# EAGLE design DRV8818_single_axis (EAGLE 7.6.0)
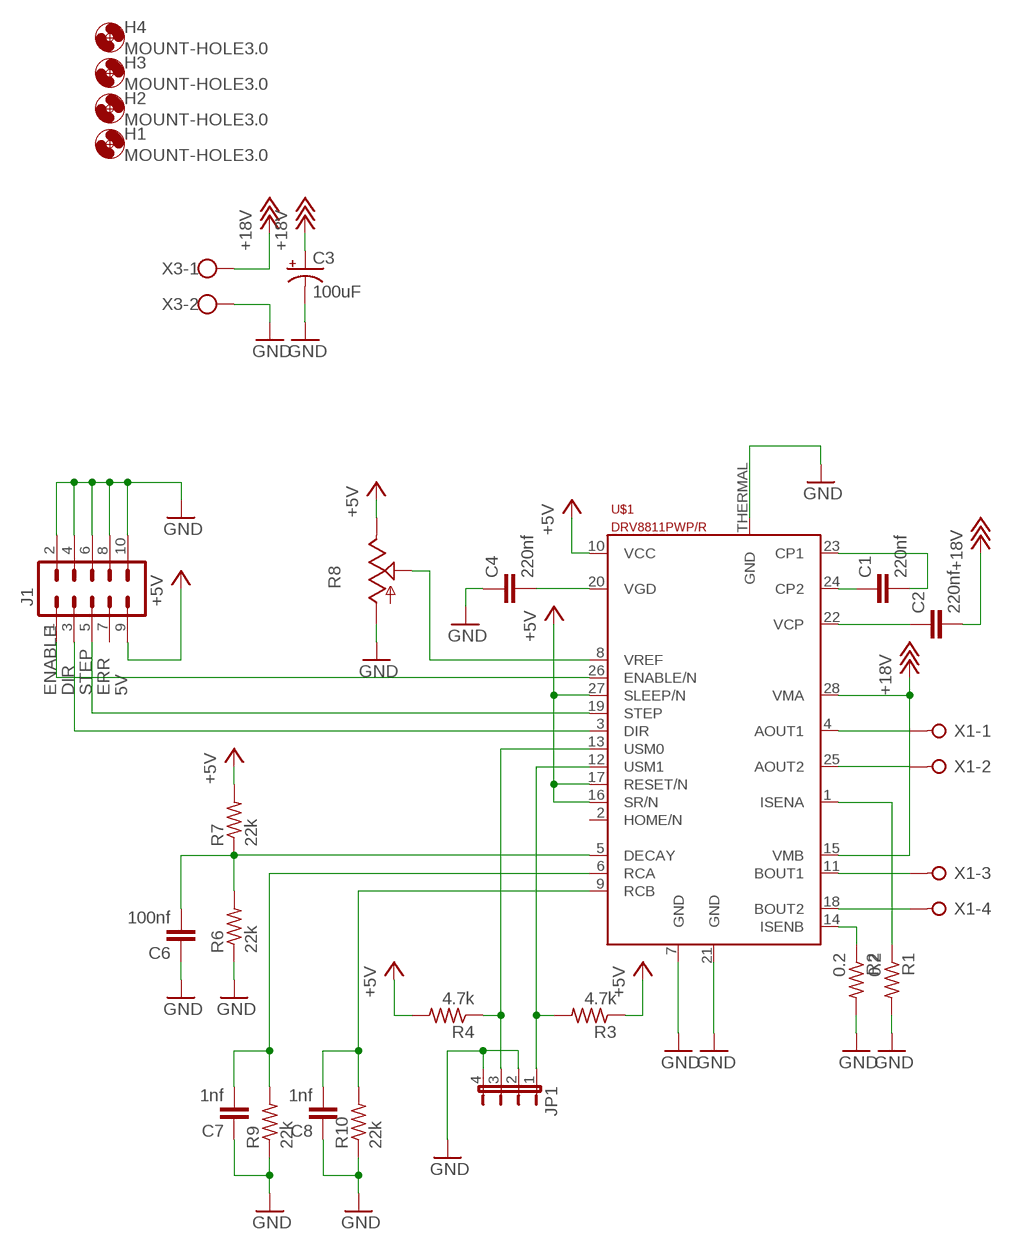
[diagram p0: schematic, sheet 1]

## Parts
C1  220nf  C-EUC1206  [C1206]
C2  220nf  C-EUC1206  [C1206]
C3  100uF  100UF-63V-20%(ELECT)  [NIC_10X10.5_CAP]
C4  220nf  C-EUC1206  [C1206]
C6  100nf  C-EUC1206  [C1206]
C7  1nf  C-EUC1206  [C1206]
C8  1nf  C-EUC1206  [C1206]
H1  MOUNT-HOLE3.0  [3,0]
H2  MOUNT-HOLE3.0  [3,0]
H3  MOUNT-HOLE3.0  [3,0]
H4  MOUNT-HOLE3.0  [3,0]
J1  M05X2SHD_LOCK  [2X5-SHROUDED_LOCK]
JP1  JP4E  [JP4]
R1  0.2  R-US_R2512  [R2512]
R2  0.2  R-US_R2512  [R2512]
R3  4.7k  R-US_R1206  [R1206]
R4  4.7k  R-US_R1206  [R1206]
R6  22k  R-US_R1206  [R1206]
R7  22k  R-US_R1206  [R1206]
R8  TRIM_US-CA6V  [CA6V]
R9  22k  R-US_R1206  [R1206]
R10  22k  R-US_R1206  [R1206]
U$1  DRV8811PWP/R  [HTSSOP28]
X1  W237-04P  [W237-4P]
X3  W237-102  [W237-102]

## Nets
+5V: J1.9 R3.1 R4.2 R7.2 R8.E U$1.10(VCC) U$1.16(SR/N) U$1.17(RESET/N) U$1.27(SLEEP/N)
+18V: C2.2 C3.+ U$1.15(VMB) U$1.28(VMA) X3.1
DIR: J1.3 U$1.3(DIR)
ENABLE: J1.1 U$1.26(ENABLE/N)
GND: C3.- C4.1 C6.1 C7.1 C8.1 J1.2 J1.4 J1.6 J1.8 J1.10 JP1.2 JP1.4 R1.2 R2.2 R6.1 R8.A R9.1 R10.1 U$1.7(GND) U$1.21(GND) U$1.THERMAL(GND) X3.2
ISENA: R1.1 U$1.1(ISENA)
ISENB: R2.1 U$1.14(ISENB)
N$1: U$1.11(BOUT1) X1.3
N$2: U$1.18(BOUT2) X1.4
N$3: U$1.4(AOUT1) X1.1
N$4: U$1.25(AOUT2) X1.2
N$7: C1.1 U$1.24(CP2)
N$8: C1.2 U$1.23(CP1)
N$9: C4.2 U$1.20(VGD)
N$10: JP1.1 R3.2 U$1.12(USM1)
N$11: C2.1 U$1.22(VCP)
N$12: JP1.3 R4.1 U$1.13(USM0)
N$18: C6.2 R6.2 R7.1 U$1.5(DECAY)
N$19: C8.2 R10.2 U$1.9(RCB)
N$22: C7.2 R9.2 U$1.6(RCA)
STEP: J1.5 U$1.19(STEP)
VREF: R8.S U$1.8(VREF)
Unconnected: J1.7 U$1.2(HOME/N)

## Notes on the sheet
- ENABLE | DIR | STEP | ERR | 5V

## Library data of the parts
C1 C2 C4 C6-C8 = resistor:C-EU: CAPACITOR, European symbol
C3 = SparkFun-Capacitors:100UF-63V-20%(ELECT): CAP-08362 100uF electrolytic SMT 63V 20%; PROD_ID: CAP-08362
H1-H4 = holes:MOUNT-HOLE: MOUNTING HOLE with drill center marker
J1 = SparkFun-Connectors:M05X2: Header 5x2 Standard 10-pin dual row 0.1" header. Commonly used with AVR-ISP. Use with Spark Fun Electronics SKU: PRT-00778
JP1 = jumper:JP4E: JUMPER
R1-R4 R6 R7 R9 R10 = resistor:R-US_: RESISTOR, American symbol
R8 = pot:TRIM_US-: POTENTIOMETER
U$1 = texas-drv8811:DRV8811: Stepper Motor Controller The DRV8811 IC provides an integrated stepper motor driver solution. The device has two H-bridge drivers, as well as microstepping indexer logic to control a stepper motor. The output driver block for each consists of N-channel power MOSFETs configured as full H-bridges to drive the motor windings. Source: http://www.ti.com/lit/ds/symlink/drv8811.pdf; MF: TEXAS INSTRUMENTS
X1 = con-wago-508:W237-04P: WAGO SREW CLAMP; OC_FARNELL: unknown; OC_NEWARK: unknown
X3 = con-wago-500:W237-102: WAGO SCREW CLAMP; MPN: 237-102; OC_FARNELL: unknown; OC_NEWARK: 70K9898

## Board
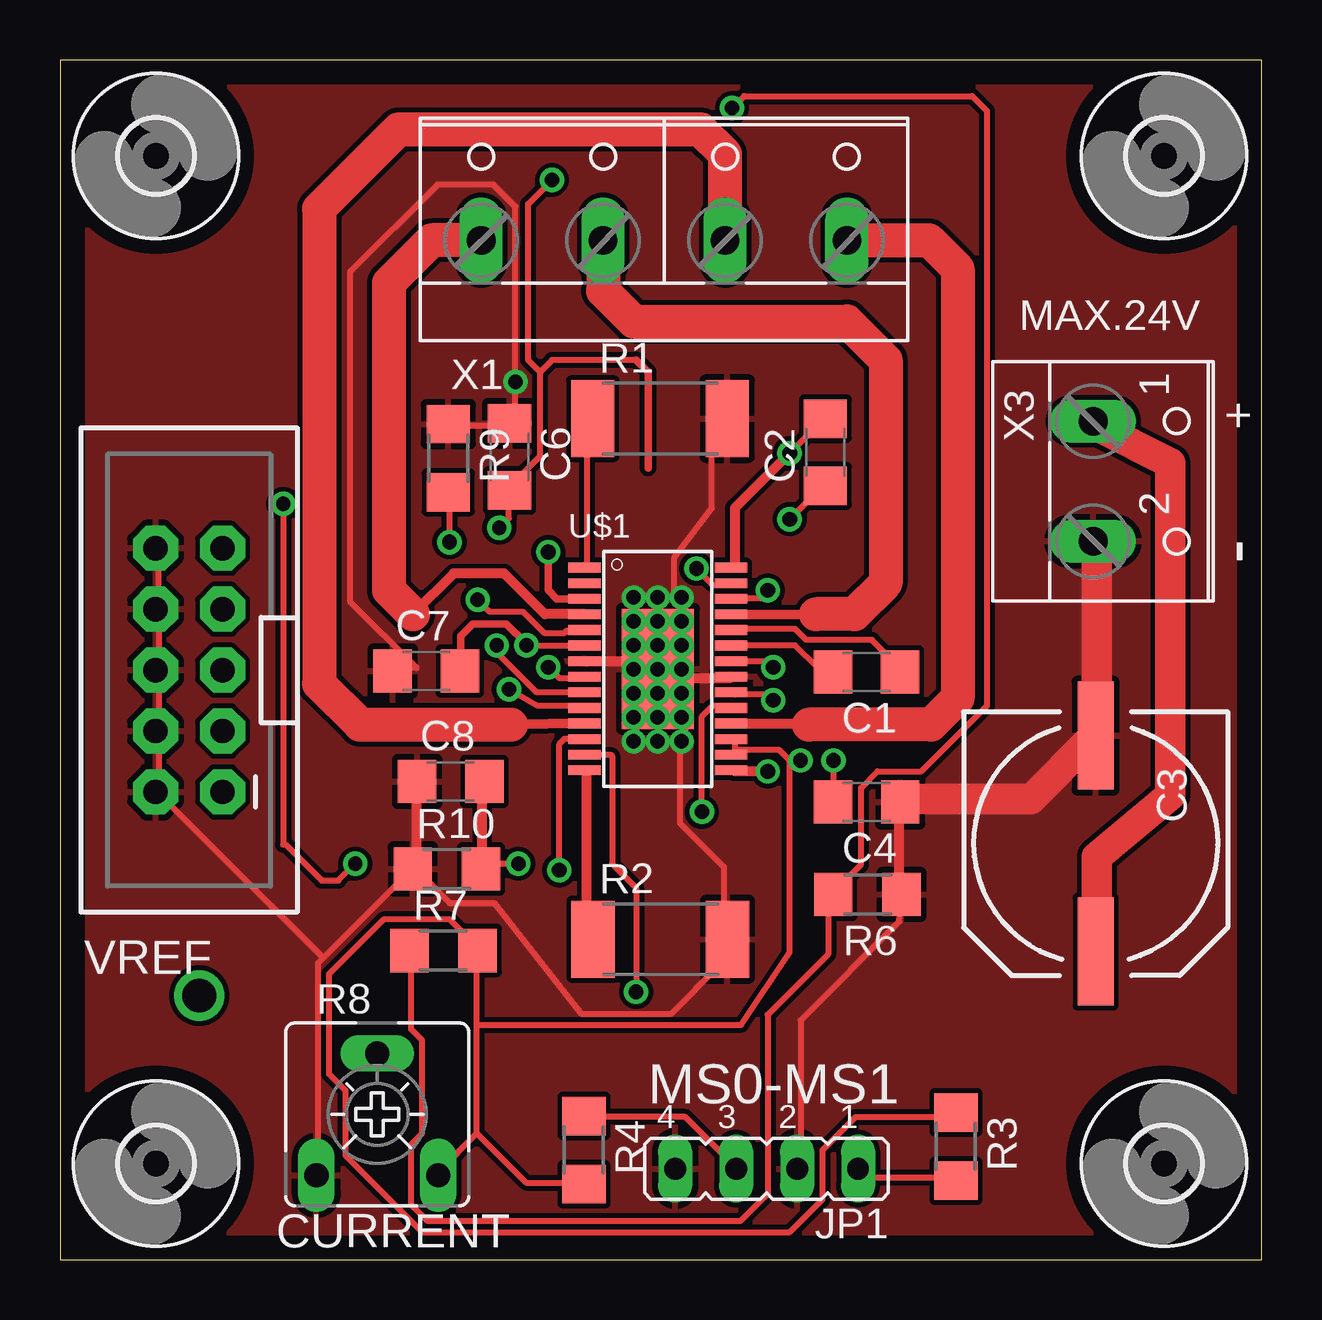
[diagram p1: board, top side]
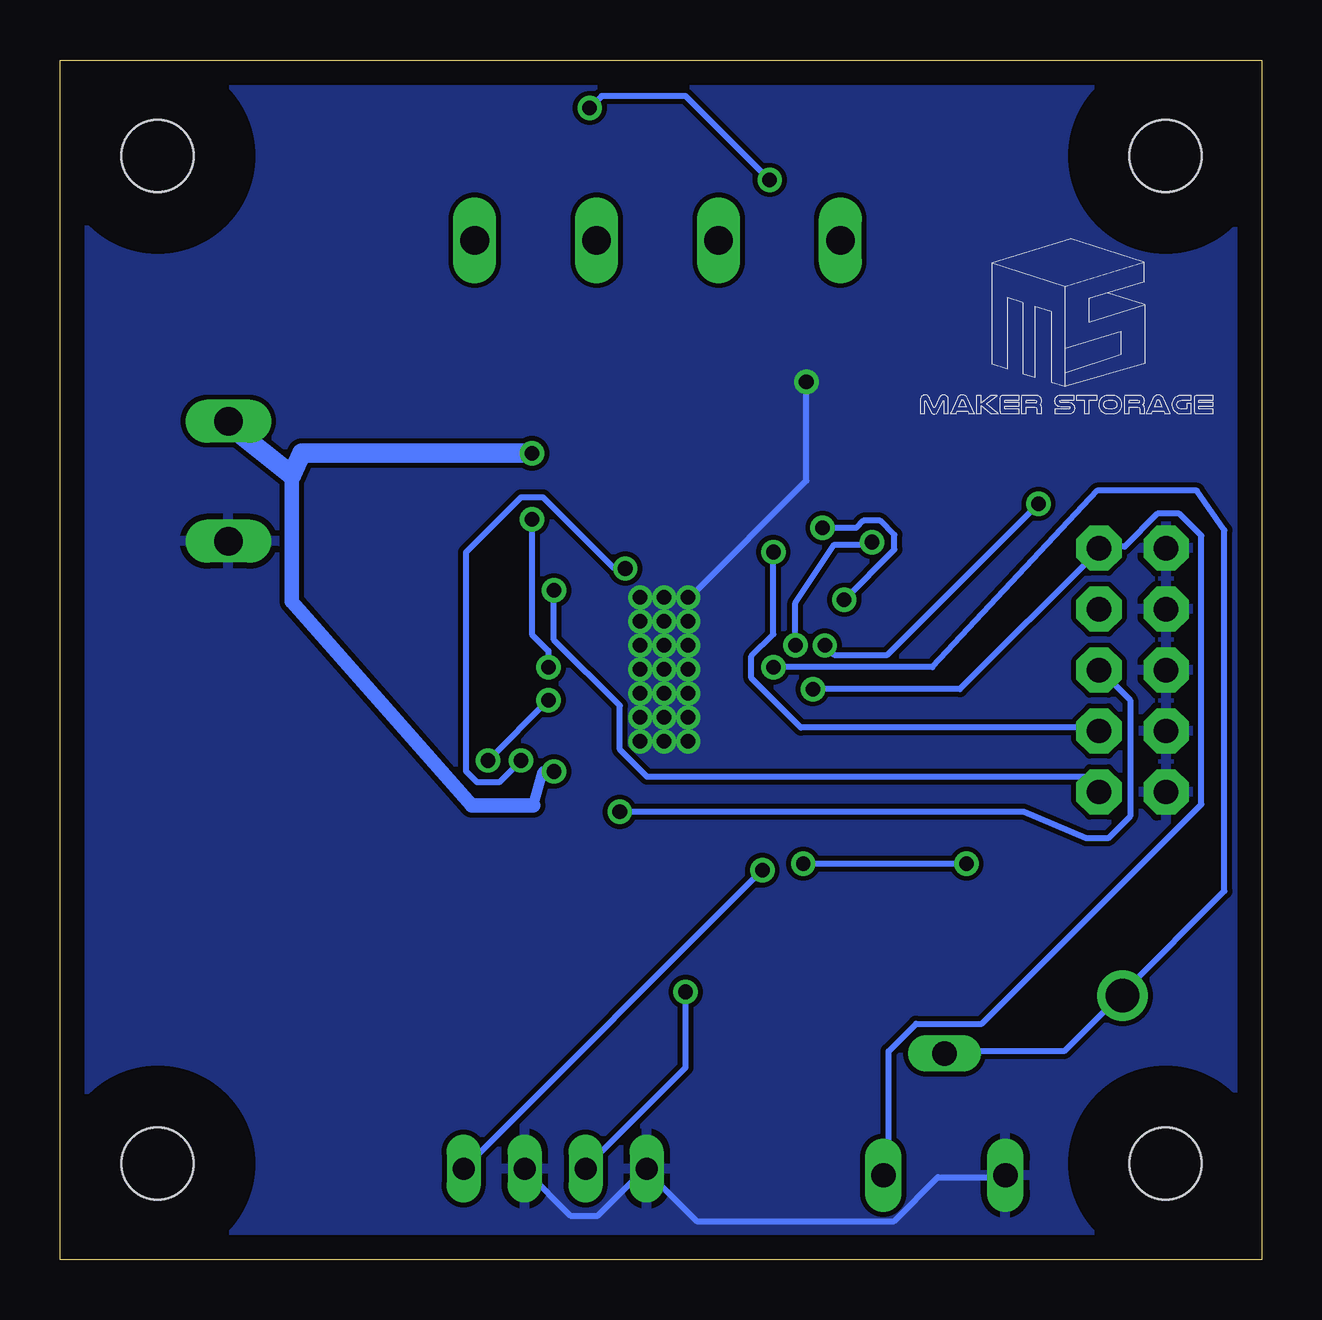
[diagram p2: board, bottom side, seen from below]

Size 50.07 x 50 mm. Coordinates in mm from the lower left corner, seen from the top.
Outline: 0,0 50.07,0 50.07,50 0,50 0,0
Copper layers (1*16): Top 0.035mm / dielectric 1.5mm / Bottom 0.035mm
Design rules "default": minimum track width 10mil, minimum drill 24mil, track to track 8mil, track to pad 8mil, pad to pad 8mil, via to via 8mil, smd to smd 8mil, copper to edge 40mil, drill to drill 8mil, minimum pad ring 10mil, minimum via ring 8mil, stop-mask expansion 4mil, vias tented up to drill 0mil, thermal gap 10mil

### Footprints (pad centres in the part's own frame; a part is rotated, then mirrored left to right if it is on the bottom)
C1206 = smd 1.6 x 1.8: 1 -1.4,0; 2 1.4,0
NIC_10X10.5_CAP = smd 4.5 x 1.5: + 4.5,0; - -4.5,0
3,0 = hole 3: 0,0
2X5-SHROUDED_LOCK = drill 1.016 pad 1.88 octagon: 1 -1.397,5.08; 2 1.397,5.08; 3 -1.397,2.54; 4 1.397,2.54; 5 -1.397,0; 6 1.397,0; 7 -1.397,-2.54; 8 1.397,-2.54; 9 -1.397,-5.08; 10 1.397,-5.08
JP4 = drill 0.914 long: 1 -3.81,0; 2 -1.27,0; 3 1.27,0; 4 3.81,0
R2512 = smd 1.8 x 3.2: 1 -2.8,0; 2 2.8,0
R1206 = smd 1.6 x 1.803: 1 -1.422,0; 2 1.422,0
CA6V = drill 1.016 long: A -2.54,-2.54; E 2.54,-2.54; S 0,2.54
HTSSOP28 = smd 1.35 x 0.4: 1 0.755,-0.855; 2 0.755,-1.505; 3 0.755,-2.16; 4 0.755,-2.805; 5 0.755,-3.46; 6 0.755,-4.105; 7 0.755,-4.755; 8 0.755,-5.405; 9 0.755,-6.055; 10 0.755,-6.71; 11 0.755,-7.355; 12 0.755,-8.01; 13 0.755,-8.655; 14 0.755,-9.305; 15 6.86,-9.305; 16 6.86,-8.655; 17 6.86,-8.01; 18 6.86,-7.355; 19 6.86,-6.71; 20 6.86,-6.055; 21 6.86,-5.405; 22 6.86,-4.755; 23 6.86,-4.105; 24 6.86,-3.46; 25 6.86,-2.805; 26 6.86,-2.16; 27 6.86,-1.505; 28 6.86,-0.855 | smd 3 x 5: THERMAL 3.81,-5.08
W237-4P = drill 1.194 long: 1 -7.62,-0.635; 2 -2.54,-0.635; 3 2.54,-0.635; 4 7.62,-0.635
W237-102 = drill 1.194 long: 1 -2.5,-1.27; 2 2.5,-1.27

### Placement (x,y rotation side)
C1  33.6,24.49 180 top
C2  31.89,33.65 90 top
C3  43.15,17.34 270 top
C4  33.61,19.07 180 top
C6  18.73,33.46 270 top
C7  15.26,24.53 0 top
C8  16.28,19.93 0 top
H1  46,46 0 top
H2  4,46 0 top
H3  4,4 0 top
H4  46,4 0 top
J1  5.38,24.57 180 top
JP1  29.44,3.79 180 top
R1  25,35.05 0 top
R2  25.01,13.35 0 top
R3  37.33,4.71 270 top
R4  21.83,4.56 270 top
R6  33.64,15.22 180 top
R7  15.98,12.88 0 top
R8  13.22,6.05 0 top
R9  16.18,33.4 270 top
R10  16.12,16.28 0 top
U$1  21.1,29.7 0 top
X1  25.17,43.12 0 top
X3  44.32,32.44 270 top

### Tracks (layer width: path | path; a pad name or v marks a point on that pad's centre or on a via)
+5V  (via drill 0.61)
  Top 0.254: v18.7,23.77 19.89,23.09 21.72,23.09 U$1.10 | 28.12,21.26 28.12,21.72 U$1.17 | 28.12,21.26 28.12,21.03 U$1.16 | v26.52,28.8 27.2,28.12 27.89,28.12 U$1.27 | 30.4,20.8 29.95,21.26 28.12,21.26 | 17.37,5.26 17.37,9.79 | 17.37,9.79 17.37,12.8 R7.2 17.37,13.03 16.23,14.17 13.49,14.17 11.2,11.89 11.2,7.73 11.89,7.04 11.89,4.34 15.09,1.14 30.4,1.14 31.77,2.52 31.77,4.57 33.15,5.94 37.26,5.94 R3.1 | 17.37,5.26 15.77,3.66 R8.E | 17.37,5.26 19.43,3.2 21.72,3.2 R4.2 | 30.4,20.8 30.4,12.8 28.39,9.79 17.37,9.79 | 30.4,20.8 v30.86,20.8
  Bottom 0.254: v18.7,23.77 12.57,23.77 6.86,29.49 J1.9 6.63,29.72 5.71,29.72 4.34,31.09 3.43,31.09 2.52,30.18 2.52,18.97 11.66,9.83 14.4,9.83 15.54,8.69 15.54,3.66 R8.E | v26.52,28.8 26.98,28.8 29.95,31.77 30.86,31.77 33.15,29.49 33.15,20.34 32.69,19.89 31.77,19.89 v30.86,20.8
+18V  (via drill 0.61)
  Top 0.254: v30.4,33.6 31.77,34.98 C2.2 | 28.12,29.03 U$1.28 | 28.12,20.34 U$1.15 | 43.2,13.03 C3.+ | 43.2,34.75 X3.1
  Top 0.406: 28.12,29.03 28.12,31.32 v30.4,33.6 | v29.49,20.34 28.12,20.34
  Top 1.27: 43.2,13.03 43.2,16.79 46.26,19.34 46.26,33.19 43.2,34.75
  Bottom 0.254: 42.98,34.75 X3.1
  Bottom 0.406: v29.49,20.34 29.95,20.34 30.36,18.93
  Bottom 0.61: 30.36,18.93 32.92,18.93 40.42,27.43 40.42,32.69
  Bottom 0.813: 42.98,34.75 40.42,32.69 40.01,33.6 v30.4,33.6
DIR  (via drill 0.61)
  Top 0.305: U$1.3 20.7,27.54 20.34,27.9 v20.34,29.49
  Bottom 0.254: v20.34,29.49 20.34,26.06 21.26,25.15 21.26,24.23 19.2,22.17 6.86,22.17 J1.3
ENABLE  (via drill 0.61)
  Top 0.254: v29.49,27.89 29.26,27.56 28.12,27.56 U$1.26
  Bottom 0.254: v29.49,27.89 29.49,25.83 26.75,23.09 26.75,21.26 25.6,20.12 7.32,20.12 6.86,19.66 J1.1
GND  (via drill 0.6, 0.61)
  Top 0.254: C7.1 14.86,24.69 14.86,24.65 12.07,27.43 12.07,41.15 15.73,44.81 18.06,44.81 18.97,43.89 v18.97,36.58 18.97,35.2 18.75,34.98 C6.1 18.52,34.75 16.23,34.75 R9.1 | v25.9,26.6 26.06,26.75 26.06,27.43 v25.9,27.6 | v23.9,26.6 24,26.75 24,27.43 v23.9,27.6 24,27.66 24.69,27.66 v24.9,27.6 | v24.9,27.6 24.92,27.43 24.92,26.75 v24.9,26.6 24.92,26.52 24.92,25.6 v24.9,25.6 24.69,25.6 | 25.6,27.66 24.92,27.66 v24.9,27.6 | 25.6,27.66 25.83,27.66 v25.9,27.6 | v23.9,21.6 24,21.72 24,22.4 U$1.THERMAL | v24.9,21.6 24.92,21.72 24.92,22.4 U$1.THERMAL | U$1.THERMAL 26.06,22.4 26.06,21.72 v25.9,21.6 25.83,21.49 25.83,18.2 27.66,16.37 27.66,13.49 R2.2 27.66,13.26 27.48,12.26 25.46,10.24 21.72,10.24 18.1,14.86 16.23,14.86 14.86,16.23 R10.1 | v23.9,22.6 24,22.63 U$1.THERMAL | v24.9,22.6 24.92,22.63 U$1.THERMAL | v25.9,22.6 26.06,22.63 U$1.THERMAL | v23.9,23.6 24,23.55 24.23,23.32 U$1.THERMAL | v24.9,23.6 24.92,23.55 U$1.THERMAL | v25.9,23.6 25.83,23.55 25.6,23.55 U$1.THERMAL | U$1.THERMAL 24.46,24 24,24.46 v23.9,24.6 23.77,24.69 23.55,24.92 | v24.9,24.6 24.92,24.69 U$1.THERMAL | v25.9,24.6 25.83,24.46 25.38,24 U$1.THERMAL | 24.69,25.6 24,25.6 v23.9,25.6 | 24.69,25.6 U$1.THERMAL | v25.9,25.6 26.06,25.38 26.06,24.69 v25.9,24.6 | 21.95,24.92 U$1.7 | 26.29,24.23 26.06,24.46 v25.9,24.6 | 27.89,24.23 U$1.21 | 25.6,27.66 25.6,29.26 27.16,31.32 27.16,34.98 R1.2 | 25.6,27.66 v25.9,27.6 | J1.10 4.12,29.49 4.12,27.2 J1.8 4.12,26.98 4.12,24.69 J1.6 4.12,24.46 4.12,22.17 J1.4 4.12,21.95 4.12,19.66 J1.2 4.12,19.43 10.97,12.57 | 14.86,19.89 C8.1 | 14.86,16.46 R10.1 | 10.97,12.57 14.63,16.23 R10.1 | 10.97,12.57 10.74,12.34 10.74,3.66 R8.A
  Top 0.254: 34.98,18.97 C4.1 35.2,19.2 | 34.98,15.32 R6.1 34.98,14.09 30.86,9.97 30.86,3.89 JP1.2 | 42.98,21.72 C3.- 43.2,21.95 | 43.2,29.72 X3.2
  Top 0.406: 23.55,24.92 21.95,24.92 | 26.29,24.23 27.89,24.23 | 14.86,16.46 14.86,19.89 | 34.98,15.32 34.98,18.97
  Top 1.27: 35.2,19.2 40.46,19.2 42.98,21.72 | 43.2,21.95 43.2,29.72
  Bottom 0.254: v18.97,36.58 18.97,32.46 23.77,27.66 v23.9,27.6 | JP1.2 30.63,3.66 28.8,1.83 27.66,1.83 25.83,3.66 JP1.4 25.6,3.66 23.55,1.6 15.32,1.6 13.49,3.43 10.74,3.43 R8.A
  pour Bottom: 0,0 50,0 50,50 0,50
  pour Bottom: 0,0 50,0 50,50 0,50
  pour Top: 0,0 50,0 50,50 0,50
ISENA
  Top 0.254: U$1.1 21.95,29.03 21.95,34.75 22.17,34.98 R1.1
ISENB
  Top 0.254: 21.95,13.72 22.17,13.49 R2.1 | 21.95,20.34 U$1.14
  Top 0.406: 21.95,13.72 21.95,20.34
N$1
  Top 0.406: U$1.11 18.8,22.3
  Top 1.422: X1.3 27.71,46.09 26.7,47.1 14.1,47.1 10.8,43.8 10.8,24 12.5,22.3 18.8,22.3
N$2
  Top 0.406: U$1.18 31.16,22.34 31.2,22.3
  Top 1.422: X1.4 36.22,42.48 37.4,41.3 37.4,23.4 36.3,22.3 31.2,22.3
N$3
  Top 0.406: U$1.4 20.2,26.9 18.5,28.6 16.4,28.6 14.7,26.9 14.7,26.8 15,26.8
  Top 1.422: X1.1 15.48,42.48 13.7,40.7 13.7,27.9 14.7,26.9
N$4
  Top 0.406: U$1.25 31.5,26.9
  Top 1.422: X1.2 22.63,40.37 23.9,39.1 32.8,39.1 34.4,37.5 34.4,28.2 33.1,26.9 31.5,26.9
N$7
  Top 0.254: U$1.24 28.12,26.29 30.63,26.29 31.09,25.83 33.83,25.83 34.98,24.69 C1.1
N$8
  Top 0.254: U$1.23 28.12,25.6 30.63,25.6 31.55,24.69 32,24.69 C1.2
N$9  (via drill 0.61)
  Top 0.254: v29.72,23.32 29.49,23.55 28.12,23.55 U$1.20 | v32.23,20.8 32.23,19.2 C4.2
  Bottom 0.254: v32.23,20.8 v29.72,23.32
N$10  (via drill 0.61)
  Top 0.254: v20.8,16.23 20.8,21.49 21.03,21.72 21.72,21.72 U$1.12 | R3.2 37.26,3.43 33.6,3.43 33.38,3.66 JP1.1
  Bottom 0.254: v20.8,16.23 33.15,3.89 JP1.1
N$11  (via drill 0.61)
  Top 0.254: v29.72,24.69 29.49,24.92 28.12,24.92 U$1.22 | v30.4,30.86 31.77,32.23 C2.1
  Bottom 0.254: v29.72,24.69 29.72,25.38 30.4,26.06 v30.4,30.86
N$12  (via drill 0.61)
  Top 0.254: U$1.13 21.95,21.03 22.97,21.03 23,21 23,16.5 24,15.5 v24,11.16 | R4.1 21.95,5.94 26.06,5.94 28.12,3.89 JP1.3
  Bottom 0.254: v24,11.16 24,8 28.12,3.89 JP1.3
N$18  (via drill 0.6)
  Top 0.254: 18.75,32.69 18.75,32.23 C6.2 | R7.1 14.63,12.8 14.63,9.6 15.09,9.14 15.09,5.26 14.63,4.8 14.63,2.29 15.32,1.6 28.35,1.6 29.49,2.74 29.49,10.2 32,12.72 32,15.09 R6.2 32.23,15.32 33.38,16.46 33.38,19.66 34.06,20.34 35.89,20.34 38.63,23.09 38.63,47.87 38,48.5 28.5,48.5 v28,48 | v20.5,45 19.5,44 19.5,37.5 20,37 | 20,37 20,33.5 19,32.5 C6.2 | 24,37.5 20.5,37.5 20,37 | v18.3,30.5 18.7,30.9 18.7,32 C6.2 | v17.4,27.5 17.9,27 19.3,27 20.2,26.1 21,26.1 21.1,26.2 21.7,26.2 U$1.5
  Top 0.305: 24.5,33 24.5,37 24,37.5 | 21.8,26.2 U$1.5
  Bottom 0.254: v28,48 27.5,48.5 24,48.5 v20.5,45 | v18.3,30.5 16.9,30.5 16.6,30.8 15.9,30.8 15.3,30.2 15.3,29.6 v17.4,27.5
N$19  (via drill 0.6)
  Top 0.254: 17.6,19.89 C8.2 | 17.6,16.46 R10.2 17.7,16.5 v19.1,16.5 19.2,16.5 | U$1.9 19.86,23.64 18.05,25.45 | 18.05,25.45 18,25.5 | 9.2,31.5 v9.3,31.5 9.3,17.3 9.4,17.3 10.9,15.8 11.6,15.8 v12.3,16.5 | 18.05,25.45 v18.2,25.6
  Top 0.406: 17.6,16.46 17.6,19.89
  Bottom 0.254: v9.3,31.5 15.6,25.2 17.8,25.2 v18.2,25.6 | v12.3,16.5 v19.1,16.5
N$22  (via drill 0.61)
  Top 0.254: U$1.6 21.72,25.6 v19.43,25.6 19.4,25.6 | 16.33,24.19 C7.2 16.6,24.59 | v16.23,29.9 16.23,31.77 R9.2
  Top 0.305: v19.43,25.6 19.43,25.67 18.6,26.5 17.2,26.5 16.7,26 16.7,24.57 C7.2
  Bottom 0.254: v19.43,25.6 19.43,27.37 17.8,29.8 16.23,29.8 v16.23,29.9
STEP  (via drill 0.61)
  Top 0.254: v26.75,18.66 26.75,22.63 27.2,23.09 27.89,23.09 U$1.19
  Bottom 0.254: v26.75,18.66 9.91,18.66 7.32,17.56 6.4,17.56 5.49,18.47 5.49,23.32 6.63,24.46 J1.5
VREF  (via drill 0.61, 1.4)
  Top 0.254: v20.34,24.69 20.8,24.23 21.72,24.23 U$1.8
  Bottom 0.254: v20.34,24.69 13.72,24.69 6.86,32.05 2.7,32.05 1.56,30.4 1.56,15.36 5.71,11.2 v5.8,11 5.94,10.97 8.23,8.69 13.03,8.69 R8.S

### Text on the board
tNames: MAX.24V | + | - | VREF | MS0-MS1 | CURRENT